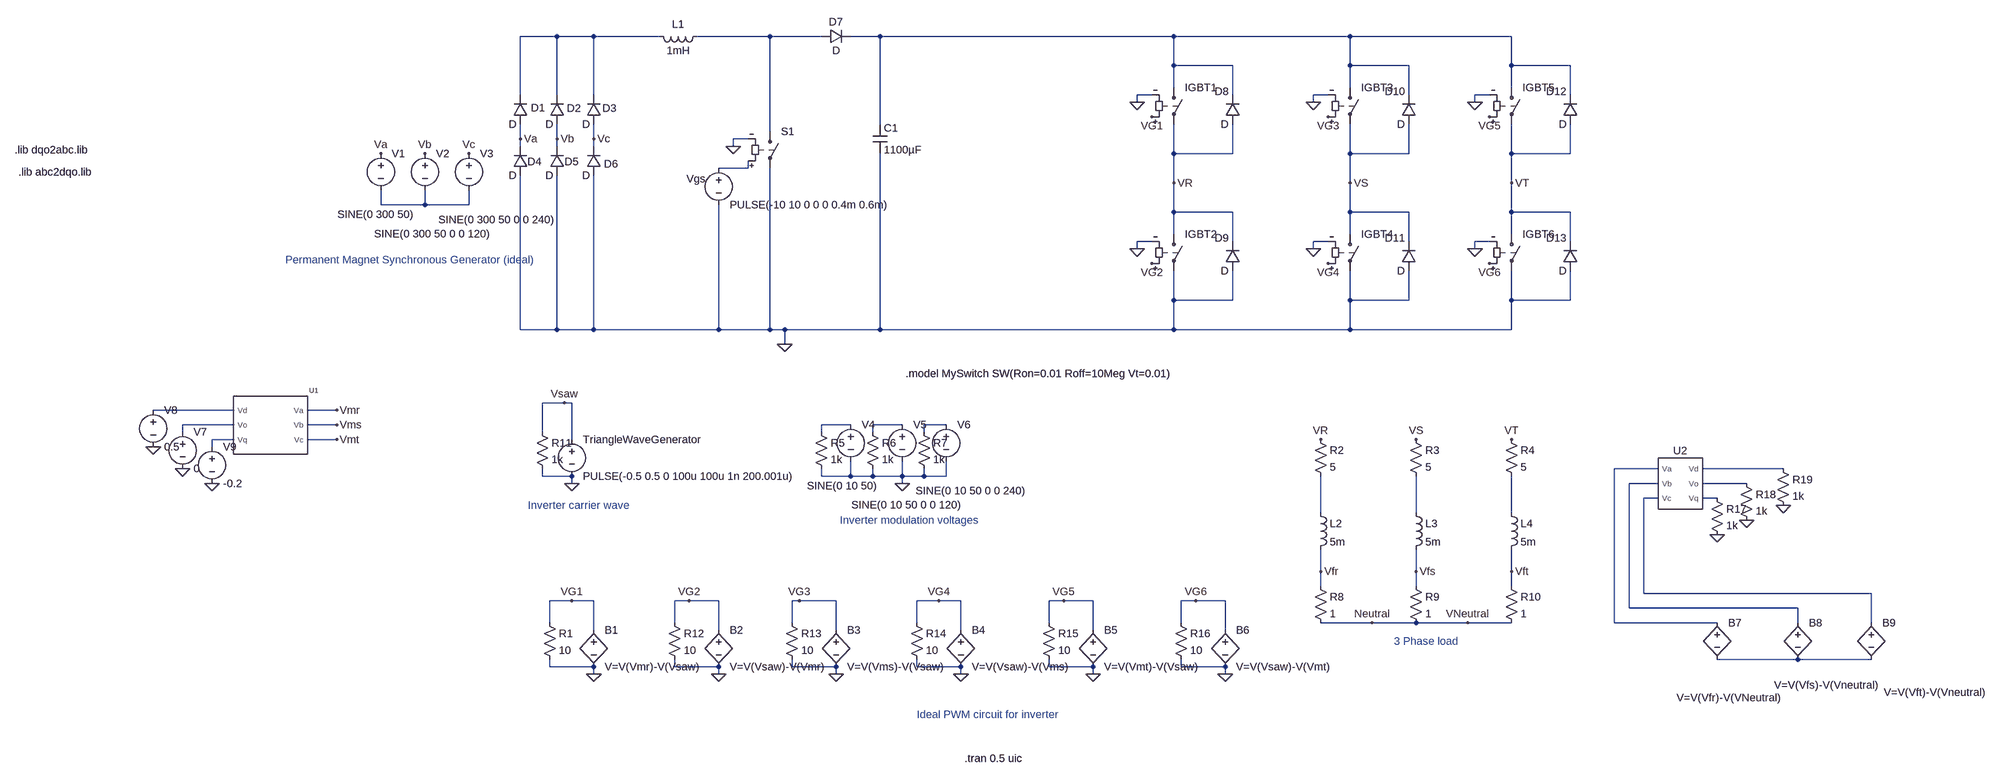
[diagram p0: schematic DCBusForVSWind1.asc]
DCBusForVSWind1.asc, the LTspice schematic file:
Version 4
SHEET 1 3872 1864
WIRE 112 -32 32 -32
WIRE 192 -32 112 -32
WIRE 336 -32 192 -32
WIRE 576 -32 416 -32
WIRE 688 -32 576 -32
WIRE 816 -32 752 -32
WIRE 1456 -32 816 -32
WIRE 1840 -32 1456 -32
WIRE 2192 -32 1840 -32
WIRE 1456 32 1456 -32
WIRE 1584 32 1456 32
WIRE 1840 32 1840 -32
WIRE 1968 32 1840 32
WIRE 2192 32 2192 -32
WIRE 2320 32 2192 32
WIRE 1456 80 1456 32
WIRE 1840 80 1840 32
WIRE 2192 80 2192 32
WIRE 32 96 32 -32
WIRE 112 96 112 -32
WIRE 192 96 192 -32
WIRE 1408 96 1376 96
WIRE 1584 96 1584 32
WIRE 1792 96 1760 96
WIRE 1968 96 1968 32
WIRE 2144 96 2112 96
WIRE 2320 96 2320 32
WIRE 1376 112 1376 96
WIRE 1760 112 1760 96
WIRE 2112 112 2112 96
WIRE 816 160 816 -32
WIRE 576 176 576 -32
WIRE 32 192 32 160
WIRE 112 192 112 160
WIRE 192 192 192 160
WIRE 528 192 496 192
WIRE 32 208 32 192
WIRE 112 208 112 192
WIRE 192 208 192 192
WIRE 496 208 496 192
WIRE 1456 224 1456 160
WIRE 1584 224 1584 160
WIRE 1584 224 1456 224
WIRE 1840 224 1840 160
WIRE 1968 224 1968 160
WIRE 1968 224 1840 224
WIRE 2192 224 2192 160
WIRE 2320 224 2320 160
WIRE 2320 224 2192 224
WIRE 528 256 528 240
WIRE 528 256 464 256
WIRE 1456 288 1456 224
WIRE 1840 288 1840 224
WIRE 2192 288 2192 224
WIRE -272 336 -272 304
WIRE -176 336 -176 304
WIRE -176 336 -272 336
WIRE -80 336 -80 304
WIRE -80 336 -176 336
WIRE 1456 352 1456 288
WIRE 1584 352 1456 352
WIRE 1840 352 1840 288
WIRE 1968 352 1840 352
WIRE 2192 352 2192 288
WIRE 2320 352 2192 352
WIRE 1456 400 1456 352
WIRE 1840 400 1840 352
WIRE 2192 400 2192 352
WIRE 1408 416 1376 416
WIRE 1584 416 1584 352
WIRE 1792 416 1760 416
WIRE 1968 416 1968 352
WIRE 2144 416 2112 416
WIRE 2320 416 2320 352
WIRE 1376 432 1376 416
WIRE 1760 432 1760 416
WIRE 2112 432 2112 416
WIRE 1456 544 1456 480
WIRE 1584 544 1584 480
WIRE 1584 544 1456 544
WIRE 1840 544 1840 480
WIRE 1968 544 1968 480
WIRE 1968 544 1840 544
WIRE 2192 544 2192 480
WIRE 2320 544 2320 480
WIRE 2320 544 2192 544
WIRE 32 608 32 272
WIRE 112 608 112 272
WIRE 112 608 32 608
WIRE 192 608 192 272
WIRE 192 608 112 608
WIRE 464 608 464 336
WIRE 464 608 192 608
WIRE 576 608 576 256
WIRE 576 608 464 608
WIRE 608 608 576 608
WIRE 816 608 816 224
WIRE 816 608 608 608
WIRE 1456 608 1456 544
WIRE 1456 608 816 608
WIRE 1840 608 1840 544
WIRE 1840 608 1456 608
WIRE 2192 608 2192 544
WIRE 2192 608 1840 608
WIRE 608 640 608 608
WIRE 128 768 80 768
WIRE 144 768 128 768
WIRE -592 784 -768 784
WIRE -368 784 -432 784
WIRE -592 816 -704 816
WIRE -368 816 -432 816
WIRE 752 816 688 816
WIRE 864 816 800 816
WIRE 960 816 912 816
WIRE -704 832 -704 816
WIRE 80 832 80 768
WIRE 688 832 688 816
WIRE 800 832 800 816
WIRE 912 832 912 816
WIRE -592 848 -640 848
WIRE -368 848 -432 848
WIRE 144 848 144 768
WIRE -640 864 -640 848
WIRE 2512 912 2416 912
WIRE 2784 912 2608 912
WIRE 80 928 80 912
WIRE 144 928 80 928
WIRE 688 928 688 912
WIRE 752 928 752 896
WIRE 752 928 688 928
WIRE 800 928 800 912
WIRE 800 928 752 928
WIRE 864 928 864 896
WIRE 864 928 800 928
WIRE 912 928 912 912
WIRE 912 928 864 928
WIRE 960 928 960 896
WIRE 960 928 912 928
WIRE 144 944 144 928
WIRE 864 944 864 928
WIRE 2512 944 2448 944
WIRE 2704 944 2608 944
WIRE 2512 976 2480 976
WIRE 2640 976 2608 976
WIRE 1776 1008 1776 928
WIRE 1984 1008 1984 928
WIRE 2192 1008 2192 928
WIRE 1776 1136 1776 1088
WIRE 1984 1136 1984 1088
WIRE 2192 1136 2192 1088
WIRE 1776 1168 1776 1136
WIRE 1984 1168 1984 1136
WIRE 2192 1168 2192 1136
WIRE 2480 1184 2480 976
WIRE 2976 1184 2480 1184
WIRE 144 1200 96 1200
WIRE 192 1200 144 1200
WIRE 400 1200 368 1200
WIRE 464 1200 400 1200
WIRE 640 1200 624 1200
WIRE 720 1200 640 1200
WIRE 944 1200 896 1200
WIRE 992 1200 944 1200
WIRE 1216 1200 1184 1200
WIRE 1280 1200 1216 1200
WIRE 1504 1200 1472 1200
WIRE 1568 1200 1504 1200
WIRE 2448 1216 2448 944
WIRE 2816 1216 2448 1216
WIRE 96 1248 96 1200
WIRE 368 1248 368 1200
WIRE 624 1248 624 1200
WIRE 896 1248 896 1200
WIRE 1184 1248 1184 1200
WIRE 1472 1248 1472 1200
WIRE 1888 1248 1776 1248
WIRE 1984 1248 1888 1248
WIRE 2096 1248 1984 1248
WIRE 2192 1248 2096 1248
WIRE 2416 1248 2416 912
WIRE 2640 1248 2416 1248
WIRE 2816 1248 2816 1216
WIRE 2976 1248 2976 1184
WIRE 192 1264 192 1200
WIRE 464 1264 464 1200
WIRE 720 1264 720 1200
WIRE 992 1264 992 1200
WIRE 1280 1264 1280 1200
WIRE 1568 1264 1568 1200
WIRE 2816 1328 2640 1328
WIRE 2976 1328 2816 1328
WIRE 96 1344 96 1328
WIRE 192 1344 96 1344
WIRE 368 1344 368 1328
WIRE 464 1344 368 1344
WIRE 624 1344 624 1328
WIRE 720 1344 624 1344
WIRE 896 1344 896 1328
WIRE 992 1344 896 1344
WIRE 1184 1344 1184 1328
WIRE 1280 1344 1184 1344
WIRE 1472 1344 1472 1328
WIRE 1568 1344 1472 1344
WIRE 192 1360 192 1344
WIRE 464 1360 464 1344
WIRE 720 1360 720 1344
WIRE 992 1360 992 1344
WIRE 1280 1360 1280 1344
WIRE 1568 1360 1568 1344
FLAG 32 192 Va
FLAG 112 192 Vb
FLAG 192 192 Vc
FLAG -272 224 Va
FLAG -176 224 Vb
FLAG -80 224 Vc
FLAG 608 640 0
FLAG 496 208 0
FLAG 1376 112 0
FLAG 1408 144 VG1
FLAG 1376 432 0
FLAG 1408 464 VG2
FLAG 1760 112 0
FLAG 1792 144 VG3
FLAG 1760 432 0
FLAG 1792 464 VG4
FLAG 2112 112 0
FLAG 2144 144 VG5
FLAG 2112 432 0
FLAG 2144 464 VG6
FLAG 1456 288 VR
FLAG 1840 288 VS
FLAG 2192 288 VT
FLAG 1776 848 VR
FLAG 1984 848 VS
FLAG 2192 848 VT
FLAG 1888 1248 Neutral
FLAG 144 944 0
FLAG 128 768 Vsaw
FLAG -368 784 Vmr
FLAG -368 816 Vms
FLAG -368 848 Vmt
FLAG 144 1200 VG1
FLAG 400 1200 VG2
FLAG 640 1200 VG3
FLAG 944 1200 VG4
FLAG 1216 1200 VG5
FLAG 1504 1200 VG6
FLAG 864 944 0
FLAG 192 1360 0
FLAG 464 1360 0
FLAG 720 1360 0
FLAG 992 1360 0
FLAG 1280 1360 0
FLAG 1568 1360 0
FLAG -768 864 0
FLAG -704 912 0
FLAG -640 944 0
FLAG 1776 1136 Vfr
FLAG 1984 1136 Vfs
FLAG 2192 1136 Vft
FLAG 2640 1056 0
FLAG 2704 1024 0
FLAG 2784 992 0
FLAG 2096 1248 VNeutral
SYMBOL diode 48 160 R180
WINDOW 0 -38 36 Left 0
WINDOW 3 24 0 Left 0
SYMATTR InstName D1
SYMBOL diode 128 160 R180
WINDOW 0 -36 35 Left 0
WINDOW 3 24 0 Left 0
SYMATTR InstName D2
SYMBOL diode 208 160 R180
WINDOW 0 -34 35 Left 0
WINDOW 3 24 0 Left 0
SYMATTR InstName D3
SYMBOL diode 48 272 R180
WINDOW 0 -30 30 Left 0
WINDOW 3 24 0 Left 0
SYMATTR InstName D4
SYMBOL diode 128 272 R180
WINDOW 0 -31 30 Left 0
WINDOW 3 24 0 Left 0
SYMATTR InstName D5
SYMBOL diode 208 272 R180
WINDOW 0 -37 25 Left 0
WINDOW 3 24 0 Left 0
SYMATTR InstName D6
SYMBOL voltage -272 208 R0
WINDOW 3 -95 149 Left 0
WINDOW 123 0 0 Left 0
WINDOW 39 0 0 Left 0
SYMATTR Value SINE(0 300 50)
SYMATTR InstName V1
SYMBOL voltage -176 208 R0
WINDOW 3 -111 191 Left 0
WINDOW 123 0 0 Left 0
WINDOW 39 0 0 Left 0
SYMATTR Value SINE(0 300 50 0 0 120)
SYMATTR InstName V2
SYMBOL voltage -80 208 R0
WINDOW 3 -67 160 Left 0
WINDOW 123 0 0 Left 0
WINDOW 39 0 0 Left 0
SYMATTR Value SINE(0 300 50 0 0 240)
SYMATTR InstName V3
SYMBOL ind 432 -48 R90
WINDOW 0 5 56 VBottom 0
WINDOW 3 32 56 VTop 0
SYMATTR InstName L1
SYMATTR Value 1mH
SYMBOL cap 800 160 R0
SYMATTR InstName C1
SYMATTR Value 1100µF
SYMBOL voltage 464 240 R0
WINDOW 0 -70 39 Left 0
WINDOW 123 0 0 Left 0
WINDOW 39 0 0 Left 0
SYMATTR InstName Vgs
SYMATTR Value PULSE(-10 10 0 0 0 0.4m 0.6m)
SYMBOL sw 576 160 R0
SYMATTR InstName S1
SYMATTR Value ""
SYMATTR SpiceModel MySwitch
SYMBOL diode 688 -16 R270
WINDOW 0 32 32 VTop 0
WINDOW 3 0 32 VBottom 0
SYMATTR InstName D7
SYMBOL sw 1456 64 R0
SYMATTR InstName IGBT1
SYMATTR Value ""
SYMATTR SpiceModel MySwitch
SYMBOL diode 1600 160 R180
WINDOW 0 24 72 Left 0
WINDOW 3 24 0 Left 0
SYMATTR InstName D8
SYMBOL sw 1456 384 R0
SYMATTR InstName IGBT2
SYMATTR Value ""
SYMATTR SpiceModel MySwitch
SYMBOL diode 1600 480 R180
WINDOW 0 24 72 Left 0
WINDOW 3 24 0 Left 0
SYMATTR InstName D9
SYMBOL sw 1840 64 R0
SYMATTR InstName IGBT3
SYMATTR Value ""
SYMATTR SpiceModel MySwitch
SYMBOL diode 1984 160 R180
WINDOW 0 24 72 Left 0
WINDOW 3 24 0 Left 0
SYMATTR InstName D10
SYMBOL sw 1840 384 R0
SYMATTR InstName IGBT4
SYMATTR Value ""
SYMATTR SpiceModel MySwitch
SYMBOL diode 1984 480 R180
WINDOW 0 24 72 Left 0
WINDOW 3 24 0 Left 0
SYMATTR InstName D11
SYMBOL sw 2192 64 R0
SYMATTR InstName IGBT5
SYMATTR Value ""
SYMATTR SpiceModel MySwitch
SYMBOL diode 2336 160 R180
WINDOW 0 24 72 Left 0
WINDOW 3 24 0 Left 0
SYMATTR InstName D12
SYMBOL sw 2192 384 R0
SYMATTR InstName IGBT6
SYMATTR Value ""
SYMATTR SpiceModel MySwitch
SYMBOL diode 2336 480 R180
WINDOW 0 24 72 Left 0
WINDOW 3 24 0 Left 0
SYMATTR InstName D13
SYMBOL res 1760 832 R0
SYMATTR InstName R2
SYMATTR Value 5
SYMBOL res 1968 832 R0
SYMATTR InstName R3
SYMATTR Value 5
SYMBOL res 2176 832 R0
SYMATTR InstName R4
SYMATTR Value 5
SYMBOL voltage 144 832 R0
WINDOW 123 0 0 Left 0
WINDOW 39 0 0 Left 0
SYMATTR InstName TriangleWaveGenerator
SYMATTR Value PULSE(-0.5 0.5 0 100u 100u 1n 200.001u)
SYMBOL voltage 752 800 R0
WINDOW 3 -95 149 Left 0
WINDOW 123 0 0 Left 0
WINDOW 39 0 0 Left 0
SYMATTR Value SINE(0 10 50)
SYMATTR InstName V4
SYMBOL voltage 864 800 R0
WINDOW 3 -111 191 Left 0
WINDOW 123 0 0 Left 0
WINDOW 39 0 0 Left 0
SYMATTR Value SINE(0 10 50 0 0 120)
SYMATTR InstName V5
SYMBOL voltage 960 800 R0
WINDOW 3 -67 160 Left 0
WINDOW 123 0 0 Left 0
WINDOW 39 0 0 Left 0
SYMATTR Value SINE(0 10 50 0 0 240)
SYMATTR InstName V6
SYMBOL res 64 816 R0
SYMATTR InstName R11
SYMATTR Value 1k
SYMBOL bv 192 1248 R0
SYMATTR InstName B1
SYMATTR Value V=V(Vmr)-V(Vsaw)
SYMBOL res 80 1232 R0
SYMATTR InstName R1
SYMATTR Value 10
SYMBOL bv 464 1248 R0
SYMATTR InstName B2
SYMATTR Value V=V(Vsaw)-V(Vmr)
SYMBOL res 352 1232 R0
SYMATTR InstName R12
SYMATTR Value 10
SYMBOL bv 720 1248 R0
SYMATTR InstName B3
SYMATTR Value V=V(Vms)-V(Vsaw)
SYMBOL res 608 1232 R0
SYMATTR InstName R13
SYMATTR Value 10
SYMBOL bv 992 1248 R0
SYMATTR InstName B4
SYMATTR Value V=V(Vsaw)-V(Vms)
SYMBOL res 880 1232 R0
SYMATTR InstName R14
SYMATTR Value 10
SYMBOL bv 1280 1248 R0
SYMATTR InstName B5
SYMATTR Value V=V(Vmt)-V(Vsaw)
SYMBOL res 1168 1232 R0
SYMATTR InstName R15
SYMATTR Value 10
SYMBOL bv 1568 1248 R0
SYMATTR InstName B6
SYMATTR Value V=V(Vsaw)-V(Vmt)
SYMBOL res 1456 1232 R0
SYMATTR InstName R16
SYMATTR Value 10
SYMBOL ind 1760 992 R0
SYMATTR InstName L2
SYMATTR Value 5m
SYMBOL ind 1968 992 R0
SYMATTR InstName L3
SYMATTR Value 5m
SYMBOL ind 2176 992 R0
SYMATTR InstName L4
SYMATTR Value 5m
SYMBOL res 672 816 R0
SYMATTR InstName R5
SYMATTR Value 1k
SYMBOL res 784 816 R0
SYMATTR InstName R6
SYMATTR Value 1k
SYMBOL res 896 816 R0
SYMATTR InstName R7
SYMATTR Value 1k
SYMBOL voltage -704 816 R0
WINDOW 123 0 0 Left 0
WINDOW 39 0 0 Left 0
SYMATTR InstName V7
SYMATTR Value 0
SYMBOL voltage -768 768 R0
WINDOW 123 0 0 Left 0
WINDOW 39 0 0 Left 0
SYMATTR InstName V8
SYMATTR Value 0.5
SYMBOL voltage -640 848 R0
WINDOW 123 0 0 Left 0
WINDOW 39 0 0 Left 0
SYMATTR InstName V9
SYMATTR Value -0.2
SYMBOL abc2dqo 2560 944 R0
SYMATTR InstName U2
SYMBOL res 1760 1152 R0
SYMATTR InstName R8
SYMATTR Value 1
SYMBOL res 1968 1152 R0
SYMATTR InstName R9
SYMATTR Value 1
SYMBOL res 2176 1152 R0
SYMATTR InstName R10
SYMATTR Value 1
SYMBOL res 2624 960 R0
SYMATTR InstName R17
SYMATTR Value 1k
SYMBOL res 2688 928 R0
SYMATTR InstName R18
SYMATTR Value 1k
SYMBOL res 2768 896 R0
SYMATTR InstName R19
SYMATTR Value 1k
SYMBOL bv 2640 1232 R0
WINDOW 3 -88 180 Left 0
SYMATTR InstName B7
SYMATTR Value V=V(Vfr)-V(VNeutral)
SYMBOL bv 2816 1232 R0
WINDOW 3 -52 152 Left 0
SYMATTR InstName B8
SYMATTR Value V=V(Vfs)-V(Vneutral)
SYMBOL bv 2976 1232 R0
WINDOW 3 27 168 Left 0
SYMATTR InstName B9
SYMATTR Value V=V(Vft)-V(Vneutral)
SYMBOL dqabc -512 816 R0
SYMATTR InstName U1
TEXT 1000 1544 Left 0 !.tran 0.5 uic
TEXT 872 704 Left 0 !.model MySwitch SW(Ron=0.01 Roff=10Meg Vt=0.01)
TEXT 728 1024 Left 0 ;Inverter modulation voltages
TEXT 48 992 Left 0 ;Inverter carrier wave
TEXT 1936 1288 Left 0 ;3 Phase load
TEXT 896 1448 Left 0 ;Ideal PWM circuit for inverter
TEXT -480 456 Left 0 ;Permanent Magnet Synchronous Generator (ideal)
TEXT -1120 216 Left 0 !.lib dqo2abc.lib
TEXT -1112 264 Left 0 !.lib abc2dqo.lib

The netlist it stands for:
* DCBusForVSWind1.asc
D1 Va N001 D
D2 Vb N001 D
D3 Vc N001 D
D4 0 Va D
D5 0 Vb D
D6 0 Vc D
V1 Va N005 SINE(0 300 50)
V2 Vb N005 SINE(0 300 50 0 0 120)
V3 Vc N005 SINE(0 300 50 0 0 240)
L1 N002 N001 1mH
C1 N003 0 1100µF
Vgs N004 0 PULSE(-10 10 0 0 0 0.4m 0.6m)
S1 N002 0 N004 0 MySwitch
D7 N002 N003 D
S§IGBT1 N003 VR VG1 0 MySwitch
D8 VR N003 D
S§IGBT2 VR 0 VG2 0 MySwitch
D9 0 VR D
S§IGBT3 N003 VS VG3 0 MySwitch
D10 VS N003 D
S§IGBT4 VS 0 VG4 0 MySwitch
D11 0 VS D
S§IGBT5 N003 VT VG5 0 MySwitch
D12 VT N003 D
S§IGBT6 VT 0 VG6 0 MySwitch
D13 0 VT D
R2 VR N018 5
R3 VS N019 5
R4 VT N020 5
V§TriangleWaveGenerator Vsaw 0 PULSE(-0.5 0.5 0 100u 100u 1n 200.001u)
V4 N008 0 SINE(0 10 50)
V5 N009 0 SINE(0 10 50 0 0 120)
V6 N010 0 SINE(0 10 50 0 0 240)
R11 Vsaw 0 1k
B1 VG1 0 V=V(Vmr)-V(Vsaw)
R1 VG1 0 10
B2 VG2 0 V=V(Vsaw)-V(Vmr)
R12 VG2 0 10
B3 VG3 0 V=V(Vms)-V(Vsaw)
R13 VG3 0 10
B4 VG4 0 V=V(Vsaw)-V(Vms)
R14 VG4 0 10
B5 VG5 0 V=V(Vmt)-V(Vsaw)
R15 VG5 0 10
B6 VG6 0 V=V(Vsaw)-V(Vmt)
R16 VG6 0 10
L2 N018 Vfr 5m
L3 N019 Vfs 5m
L4 N020 Vft 5m
R5 N008 0 1k
R6 N009 0 1k
R7 N010 0 1k
V7 N007 0 0
V8 N006 0 0.5
V9 N011 0 -0.2
XU2 N012 N014 N016 N013 N015 N017 abc2dqo  ; pins Va Vb Vc Vd Vo Vq
R8 Vfr VNeutral 1
R9 Vfs VNeutral 1
R10 Vft VNeutral 1
R17 N017 0 1k
R18 N015 0 1k
R19 N013 0 1k
B7 N012 N021 V=V(Vfr)-V(VNeutral)
B8 N014 N021 V=V(Vfs)-V(Vneutral)
B9 N016 N021 V=V(Vft)-V(Vneutral)
XU1 N006 N007 N011 Vmr Vms Vmt dqo2abc  ; pins Vd Vo Vq Va Vb Vc
.model D D
.lib standard.dio
.tran 0.5 uic
.model MySwitch SW(Ron=0.01 Roff=10Meg Vt=0.01)
* Inverter modulation voltages
* Inverter carrier wave
* 3 Phase load
* Ideal PWM circuit for inverter
* Permanent Magnet Synchronous Generator (ideal)
.lib dqo2abc.lib
.lib abc2dqo.lib
.backanno
.end